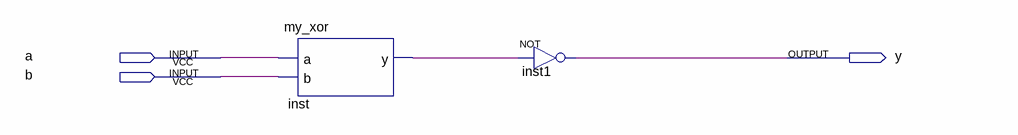
[diagram p0: schematic sheet]
// Quartus schematic my_xor_schematic.bdf as structural Verilog: 2 symbols, 3 pins
module my_xor_schematic (
  input  a,
  input  b,
  output y
);

  wire inst_y;

  my_xor inst (.a(a), .b(b), .y(inst_y));
  not inst1 (y, inst_y);
endmodule
